# Altium schematic sheet Atlas-V1.0.SchDoc
size A4
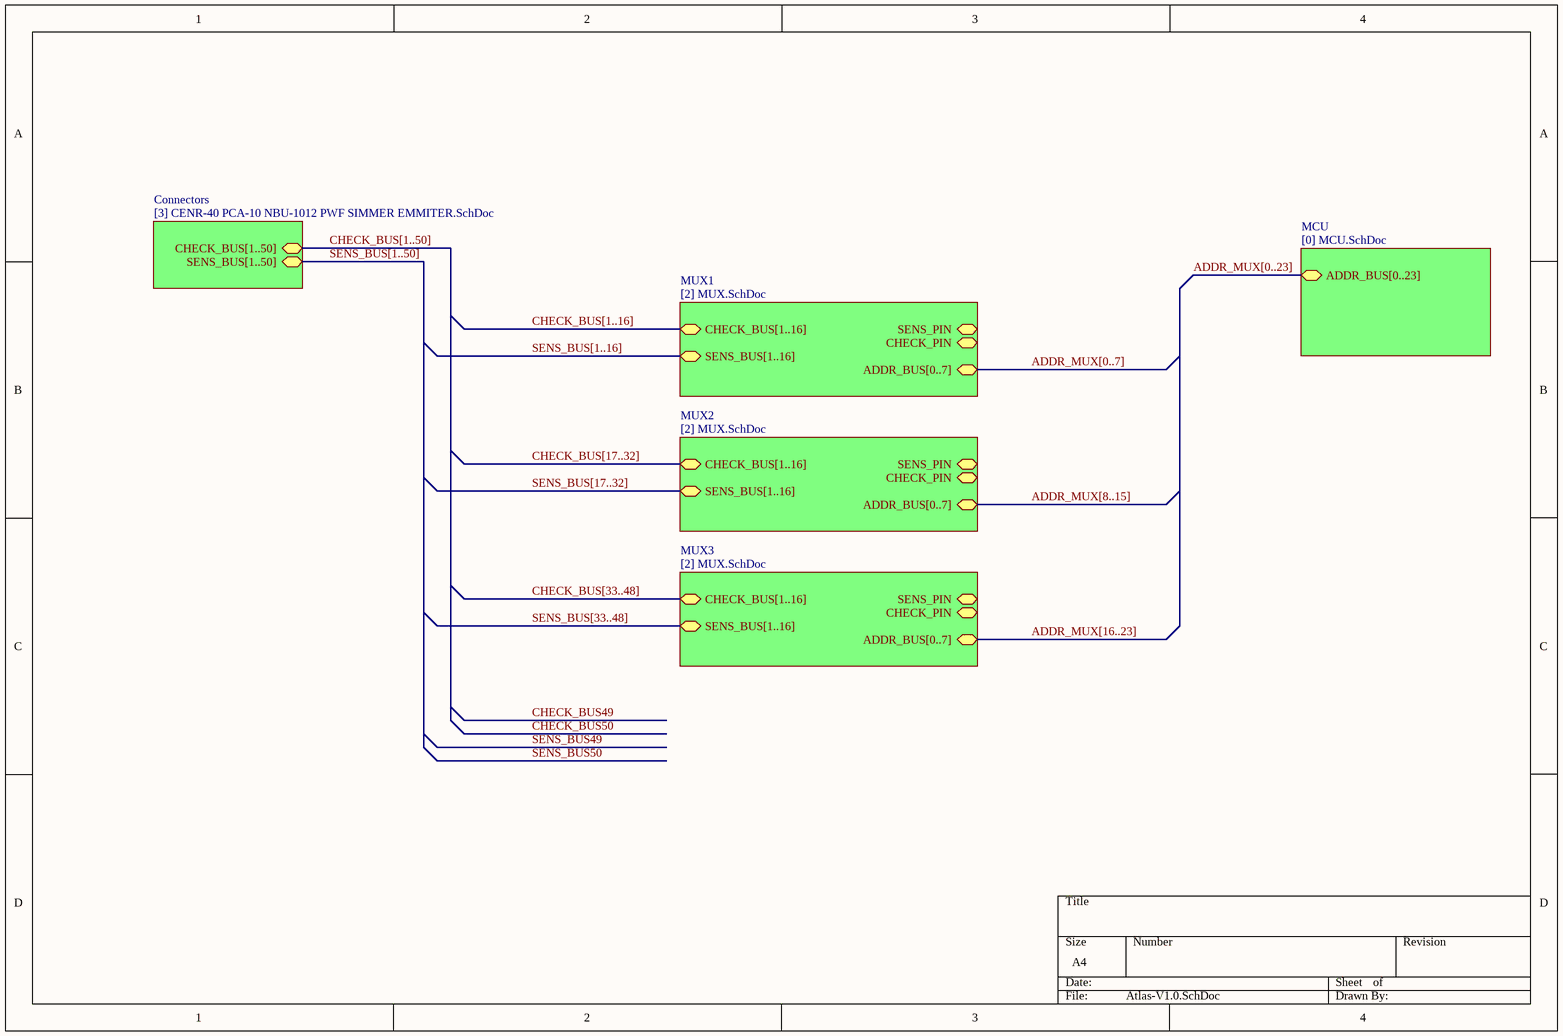
[diagram p0: Atlas-V1.0.SchDoc]

## Sub-sheets
Connectors = [3] CENR-40 PCA-10 NBU-1012 PWF SIMMER EMMITER.SchDoc: CHECK_BUS[1..50], SENS_BUS[1..50]
MCU = [0] MCU.SchDoc: ADDR_BUS[0..23]
MUX1 = [2] MUX.SchDoc: SENS_BUS[1..16], CHECK_PIN, CHECK_BUS[1..16], SENS_PIN, ADDR_BUS[0..7]
MUX2 = [2] MUX.SchDoc: SENS_BUS[1..16], CHECK_PIN, CHECK_BUS[1..16], SENS_PIN, ADDR_BUS[0..7]
MUX3 = [2] MUX.SchDoc: SENS_BUS[1..16], CHECK_PIN, CHECK_BUS[1..16], SENS_PIN, ADDR_BUS[0..7]

## Buses and harness runs
bus ADDR_MUX[0..7] = sheet MUX1/ADDR_BUS[0..7]
bus ADDR_MUX[0..23] = sheet MCU/ADDR_BUS[0..23]
bus ADDR_MUX[8..15] = sheet MUX2/ADDR_BUS[0..7]
bus ADDR_MUX[16..23] = sheet MUX3/ADDR_BUS[0..7]
bus CHECK_BUS[1..16] = sheet MUX1/CHECK_BUS[1..16]
bus CHECK_BUS[1..50] = sheet Connectors/CHECK_BUS[1..50]
bus CHECK_BUS[17..32] = sheet MUX2/CHECK_BUS[1..16]
bus CHECK_BUS[33..48] = sheet MUX3/CHECK_BUS[1..16]
bus SENS_BUS[1..16] = sheet MUX1/SENS_BUS[1..16]
bus SENS_BUS[1..50] = sheet Connectors/SENS_BUS[1..50]
bus SENS_BUS[17..32] = sheet MUX2/SENS_BUS[1..16]
bus SENS_BUS[33..48] = sheet MUX3/SENS_BUS[1..16]